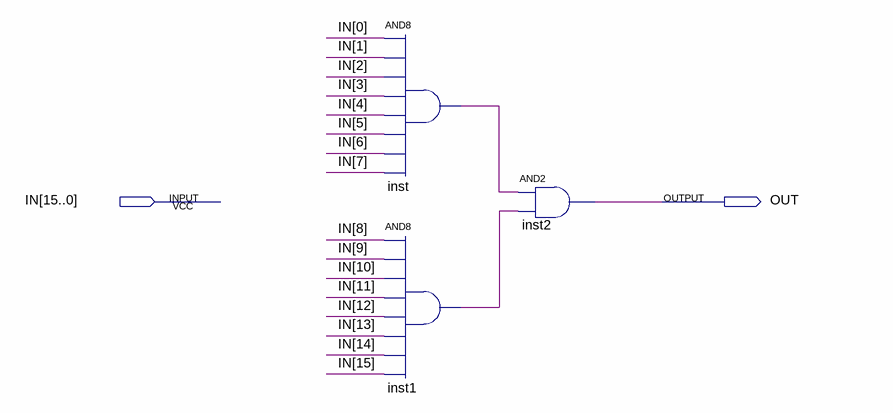
[diagram p0: schematic sheet]
// Quartus schematic AND16.bdf as structural Verilog: 3 symbols, 2 pins
module AND16 (
  input  [15:0] IN,
  output OUT
);

  wire inst1_out, inst_out;

  and inst (inst_out, IN[0], IN[1], IN[2], IN[3], IN[4], IN[5], IN[6], IN[7]);
  and inst1 (inst1_out, IN[8], IN[9], IN[10], IN[11], IN[12], IN[13], IN[14], IN[15]);
  and inst2 (OUT, inst_out, inst1_out);
endmodule
